# Altium schematic sheet 0266_GPU_VCCGT VREG PHA.SchDoc
size 848 x 558 mm
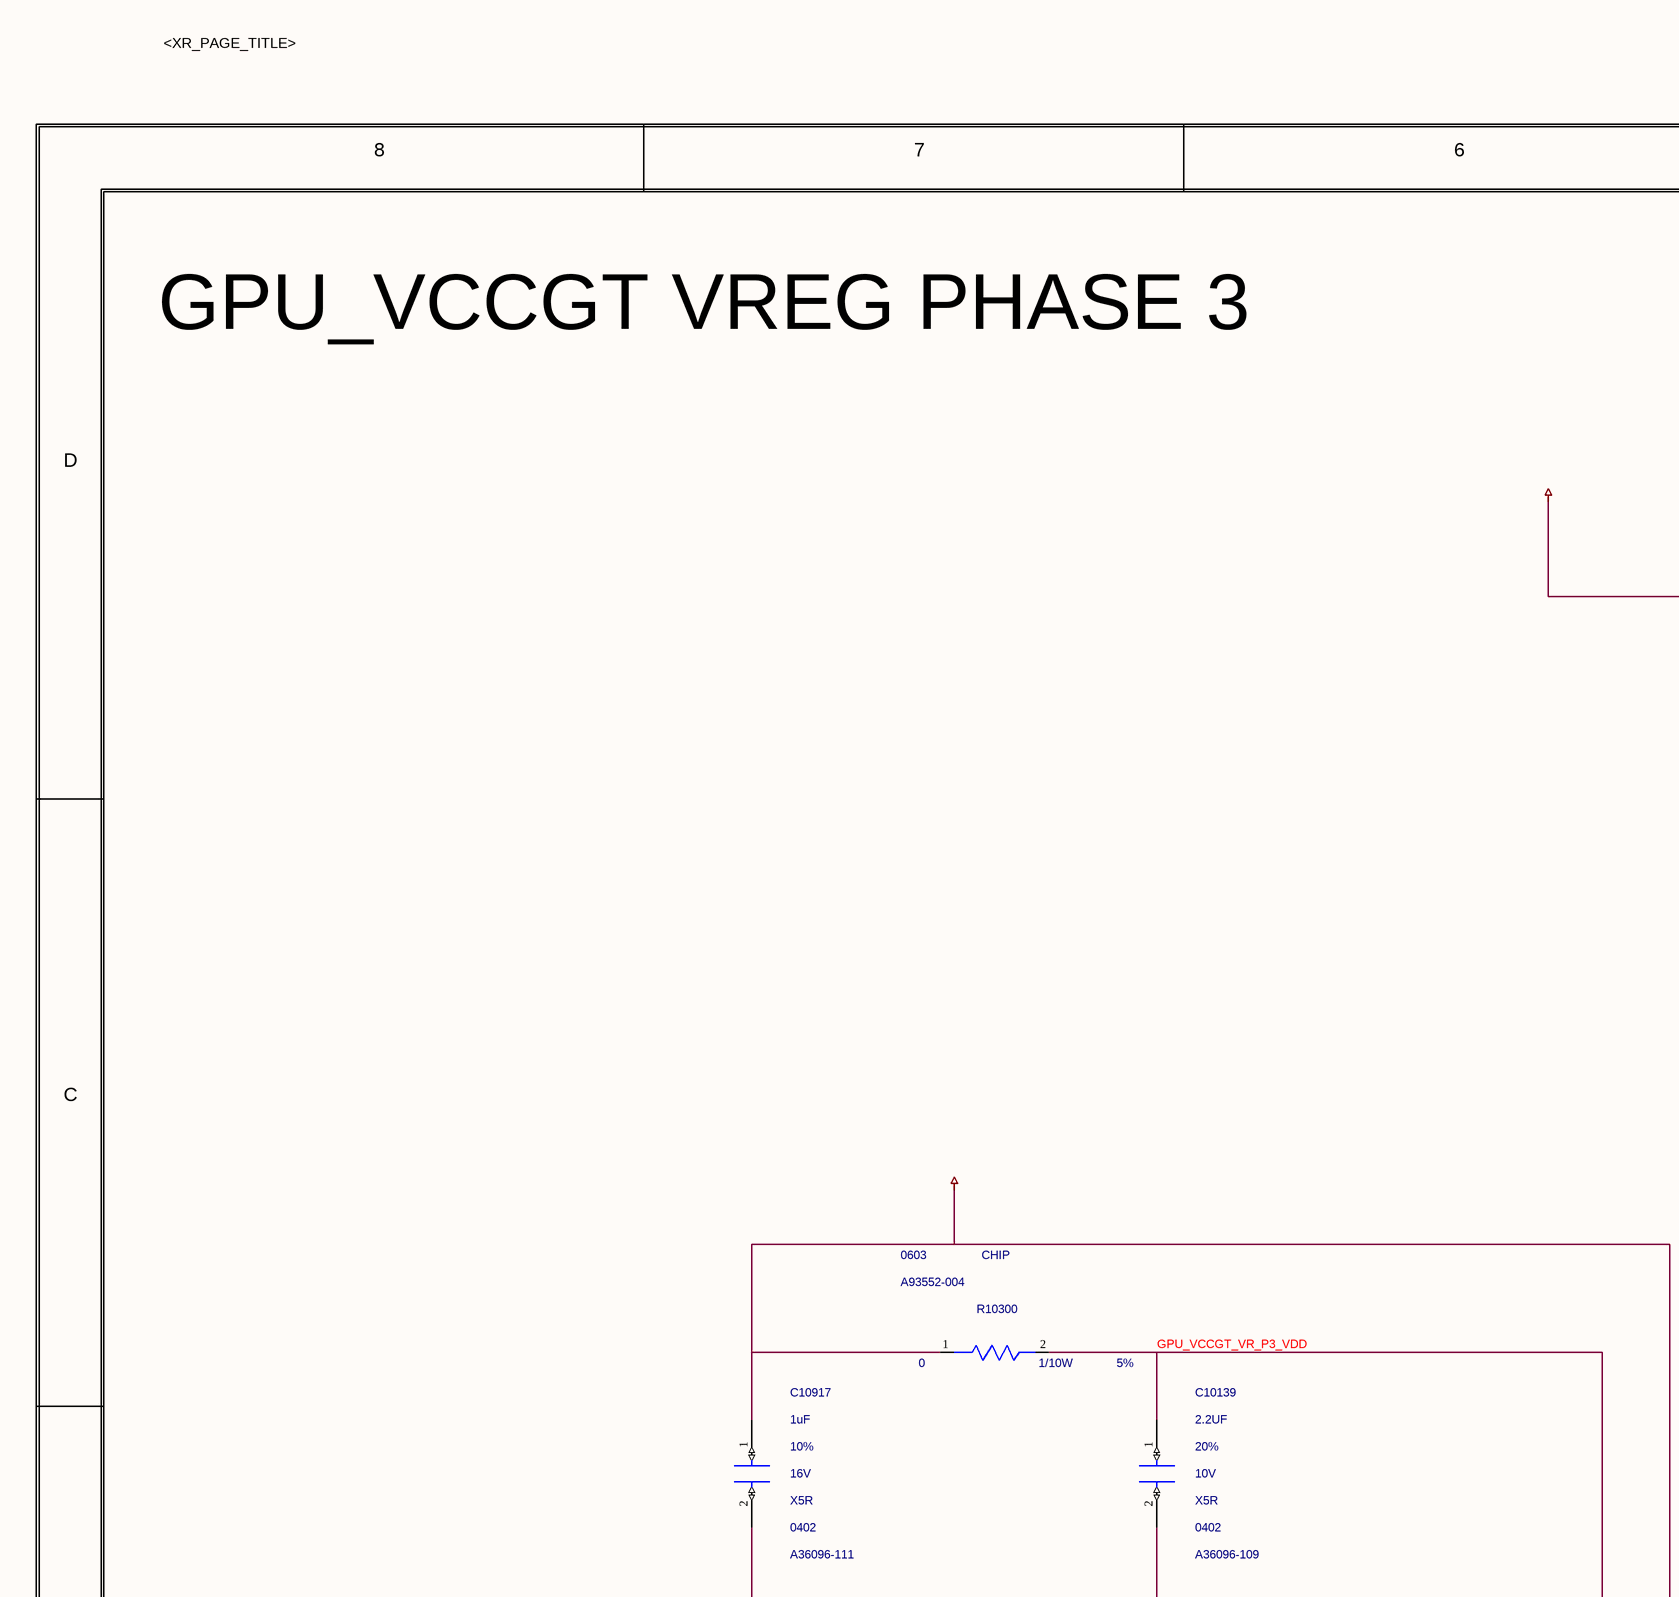
[diagram p0: 0266_GPU_VCCGT VREG PHA.SchDoc, top left]
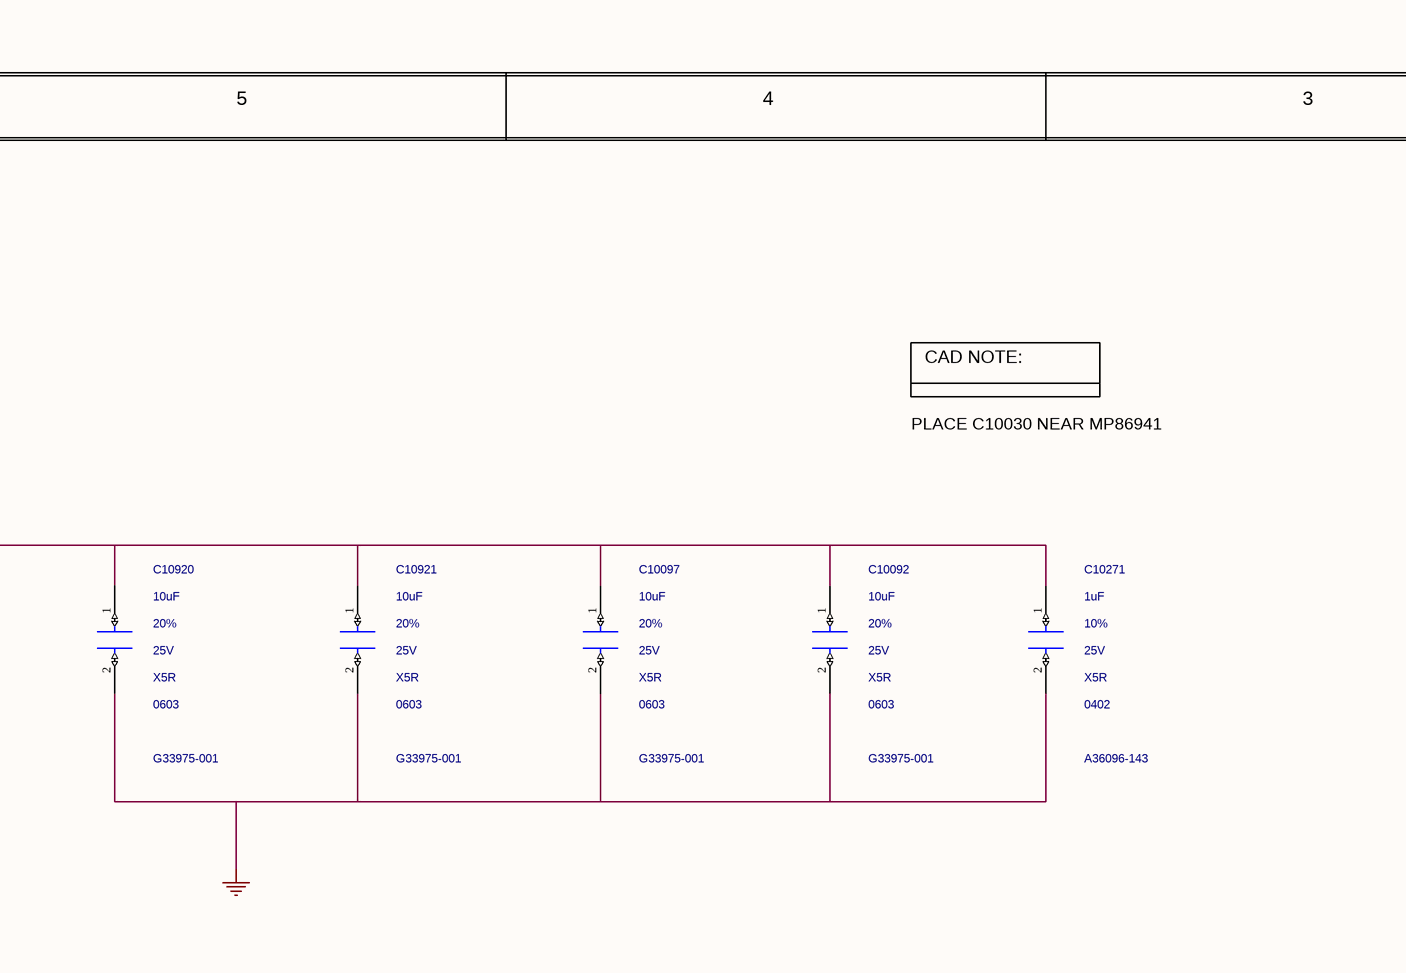
[diagram p1: 0266_GPU_VCCGT VREG PHA.SchDoc, top middle]
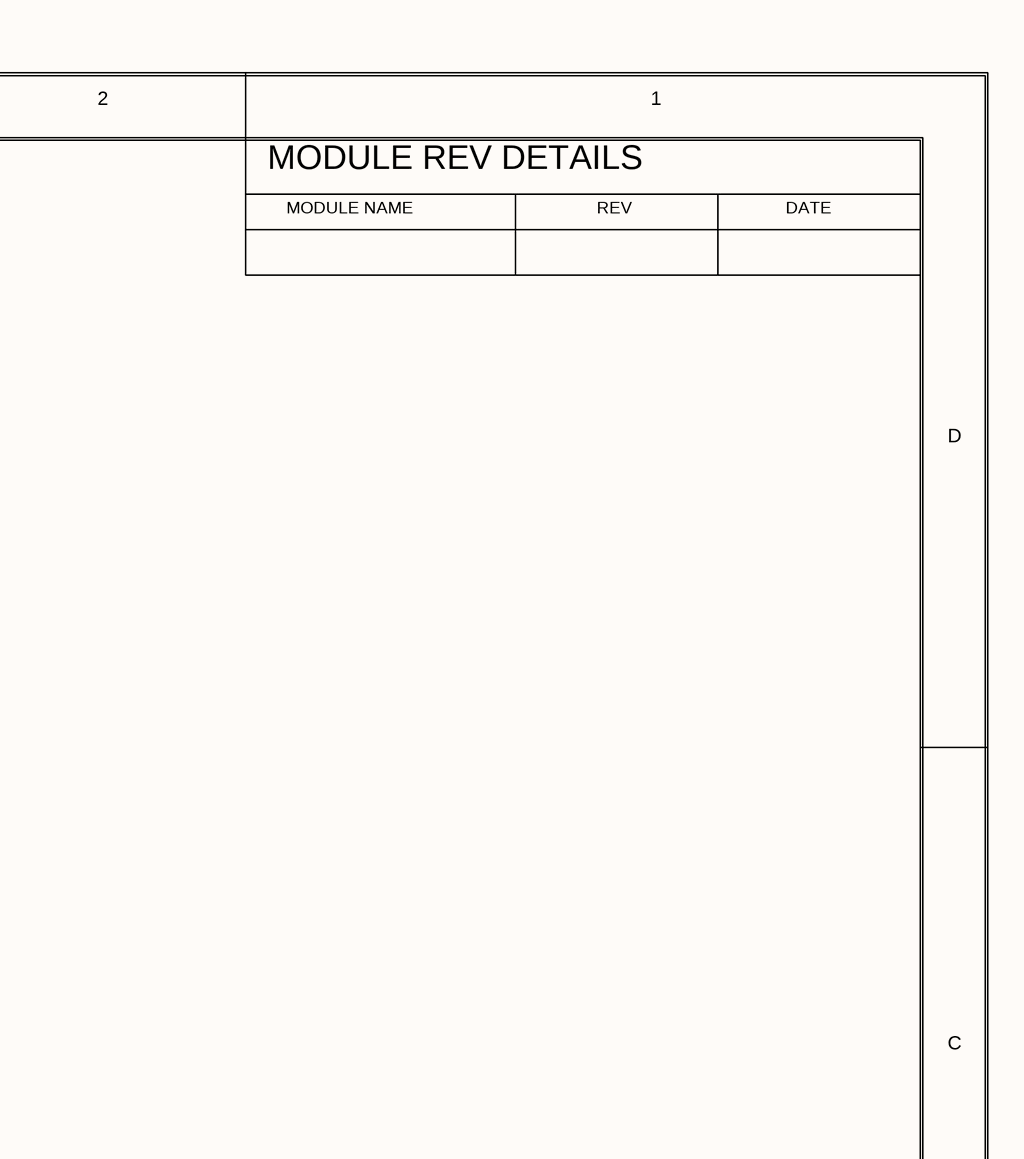
[diagram p2: 0266_GPU_VCCGT VREG PHA.SchDoc, top right]
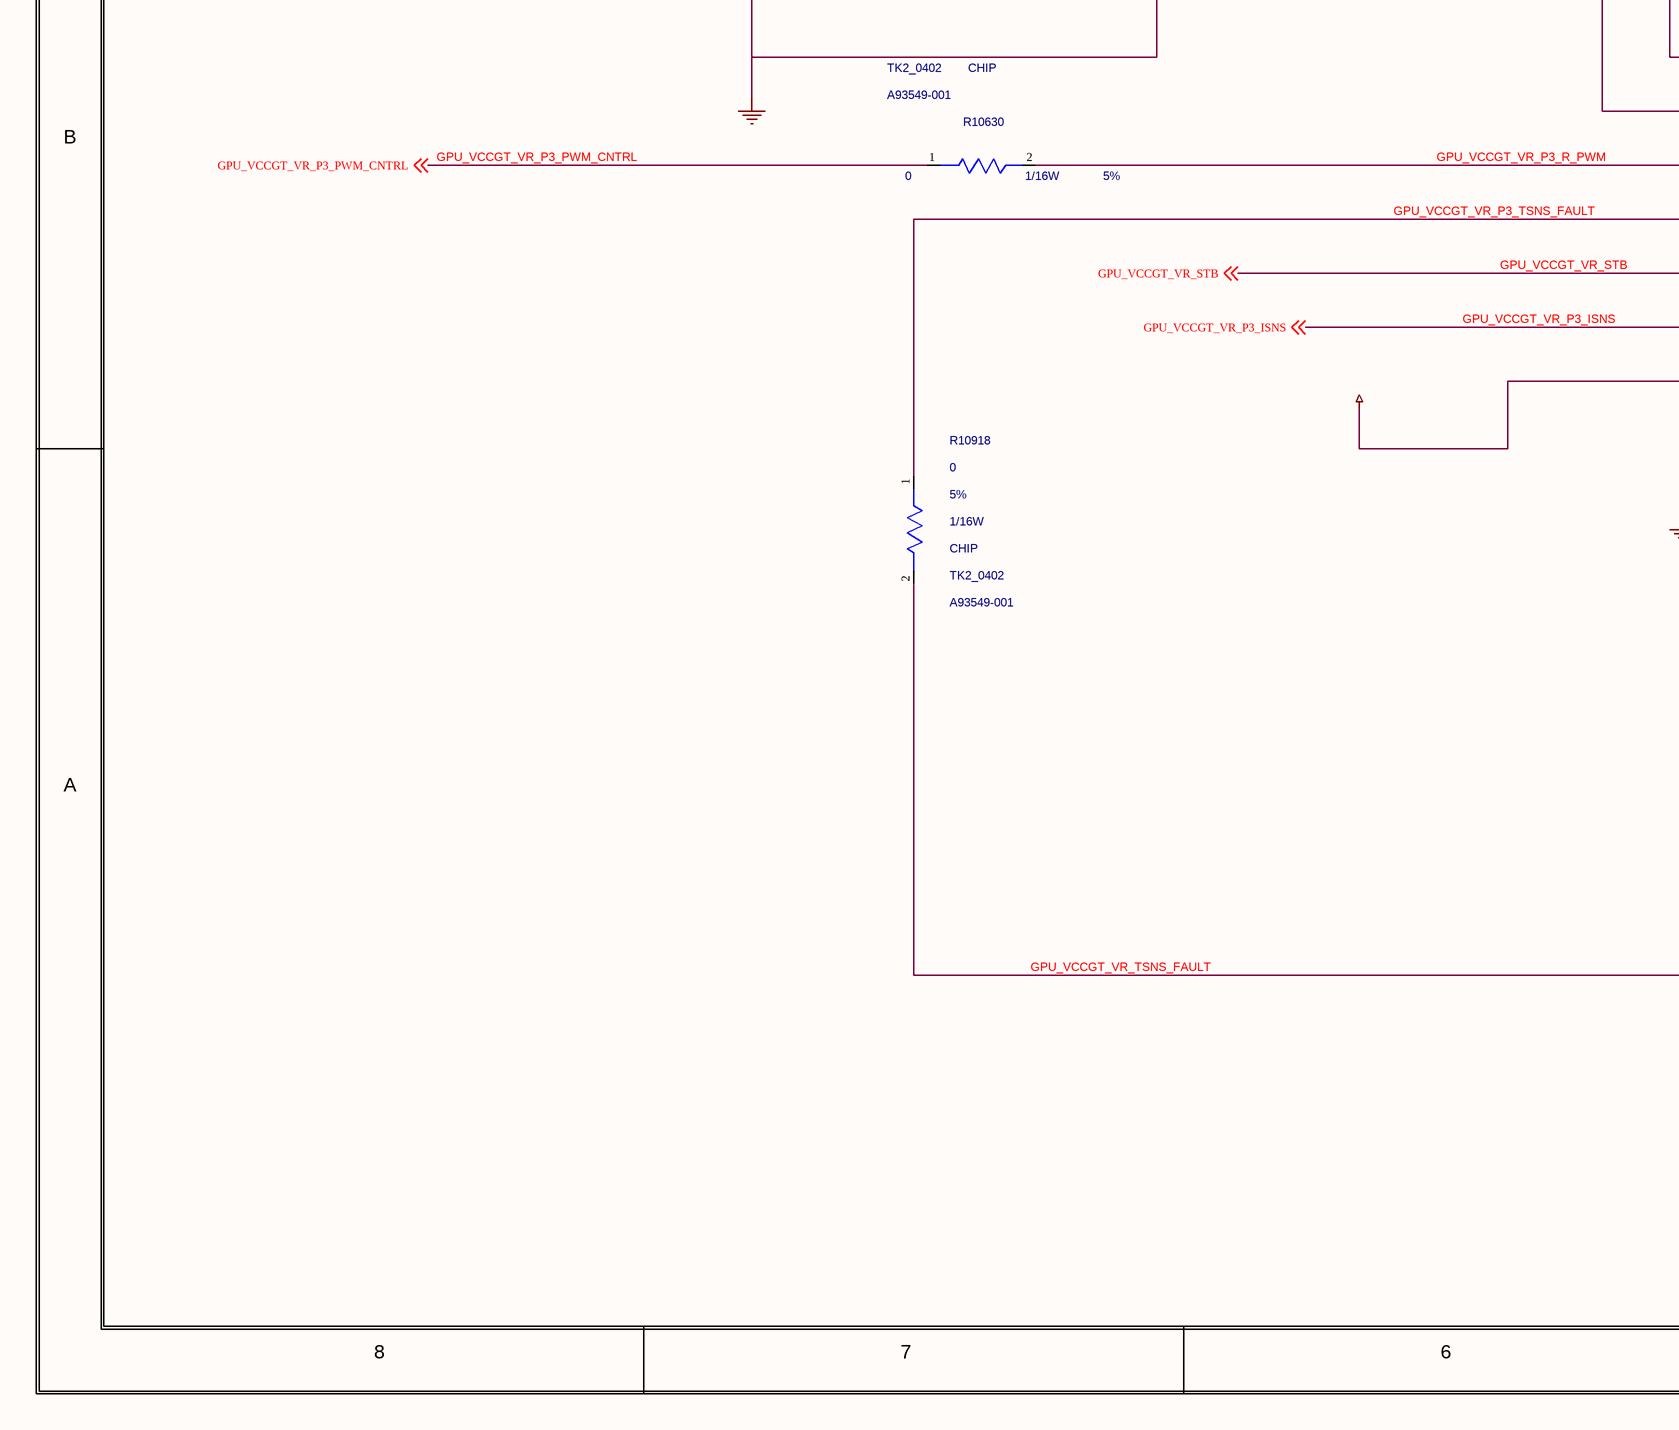
[diagram p3: 0266_GPU_VCCGT VREG PHA.SchDoc, bottom left]
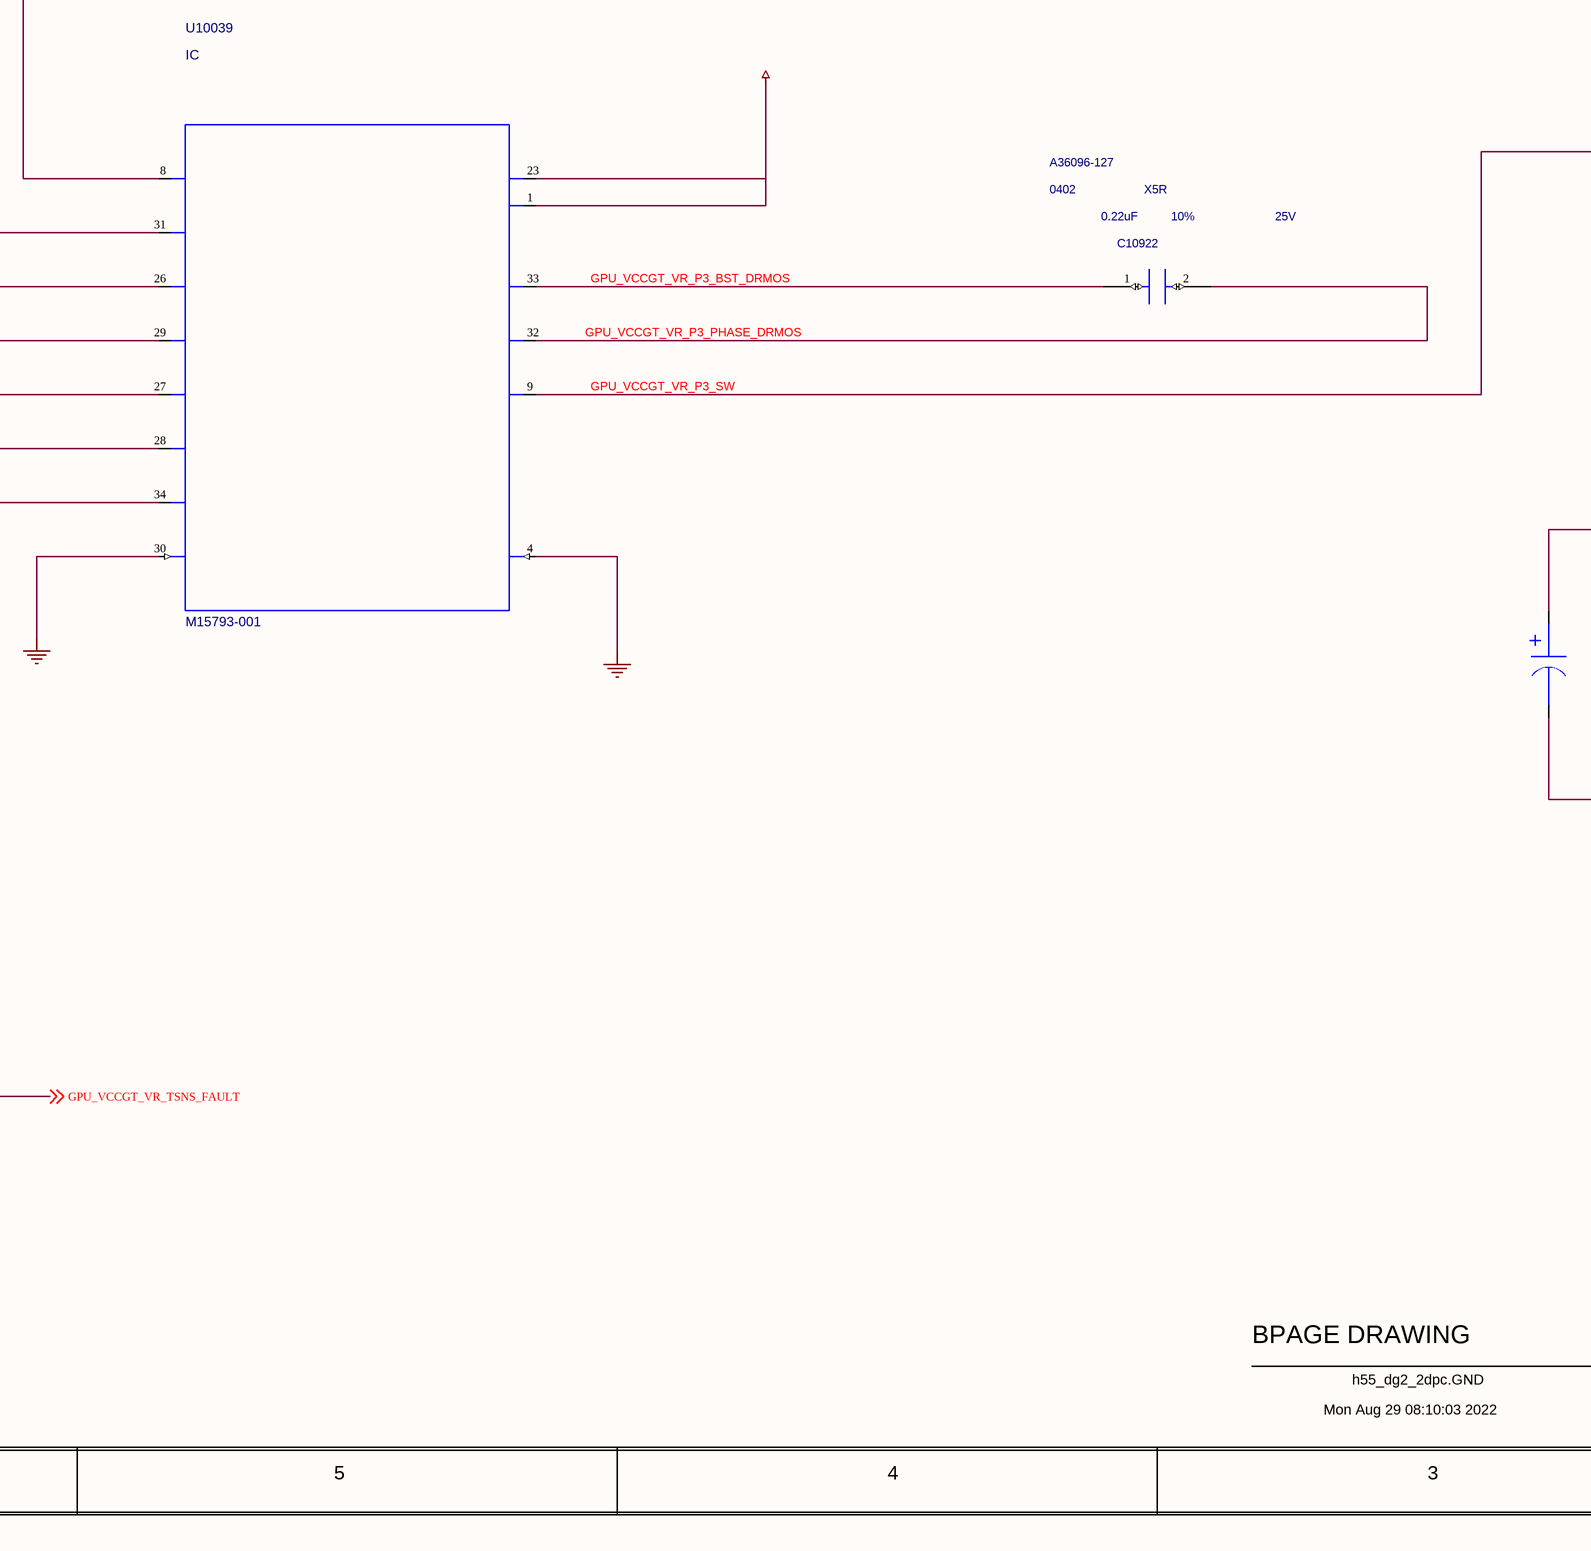
[diagram p4: 0266_GPU_VCCGT VREG PHA.SchDoc, bottom middle]
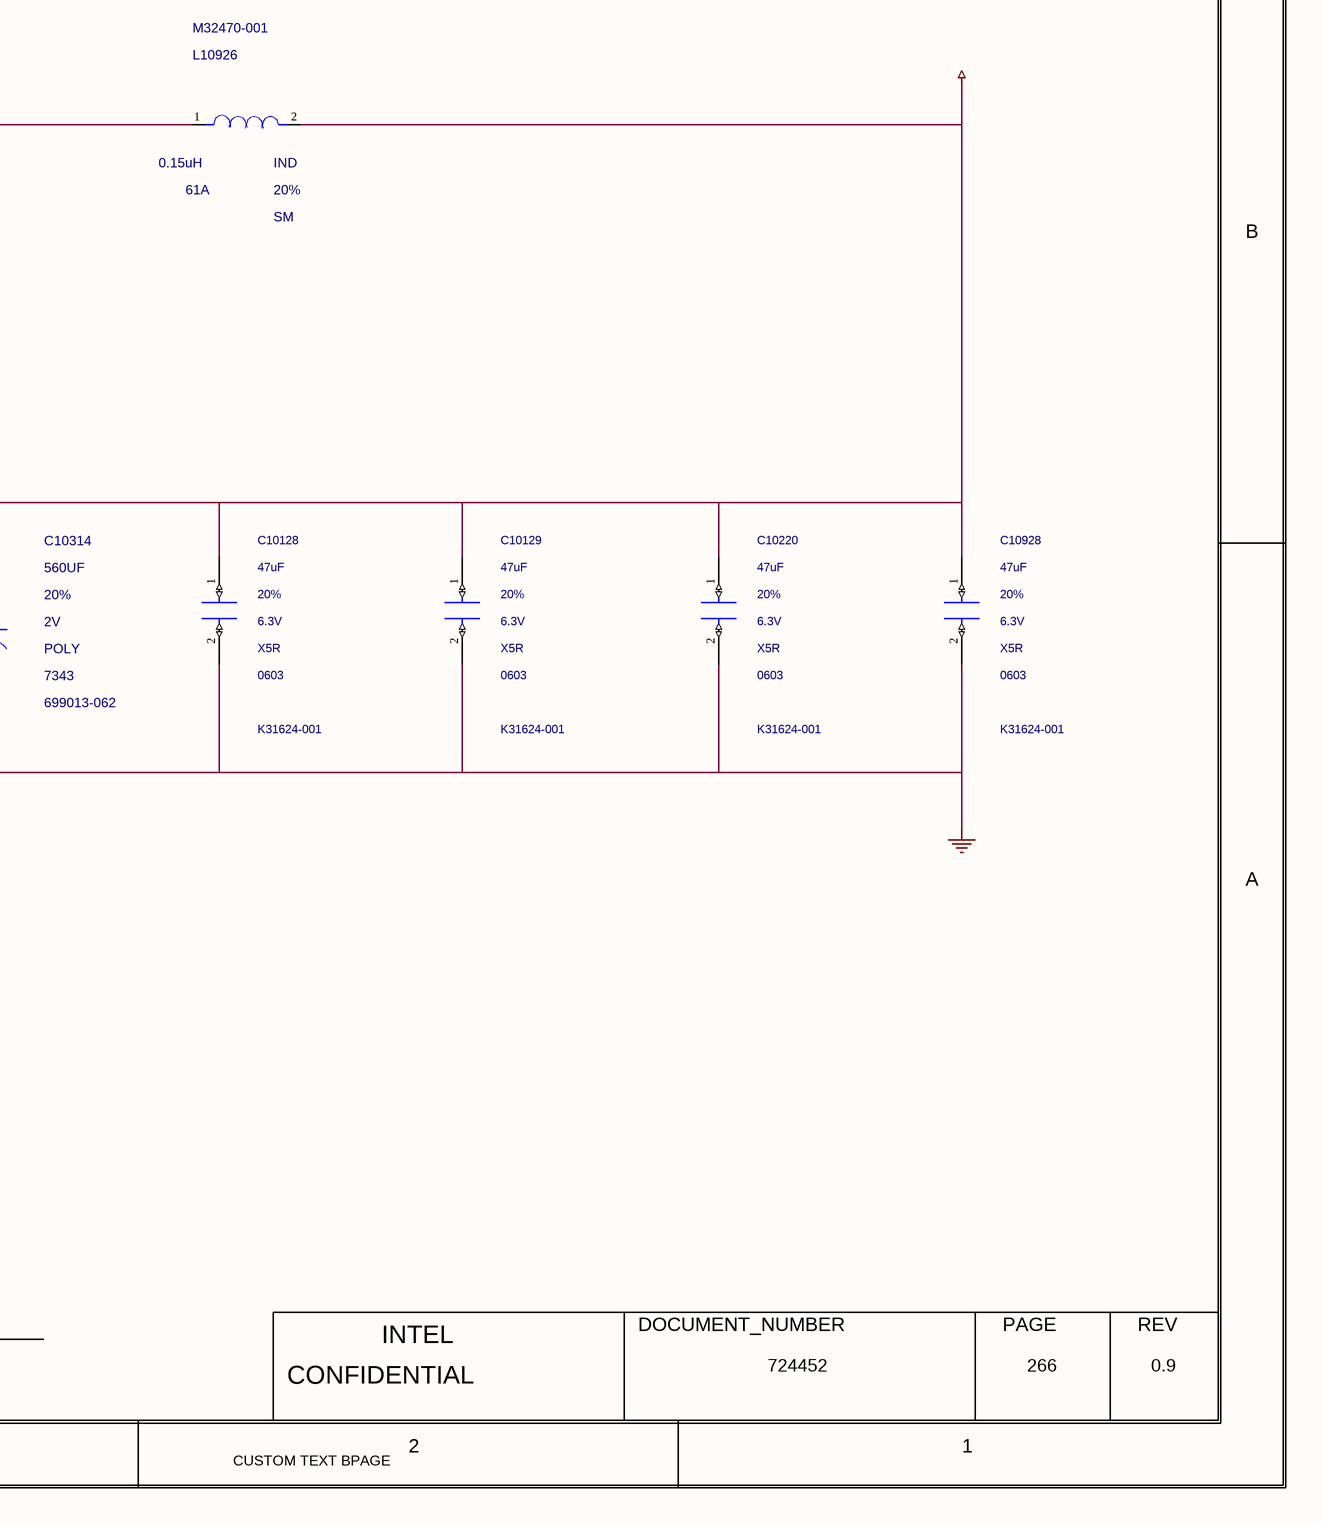
[diagram p5: 0266_GPU_VCCGT VREG PHA.SchDoc, bottom right]

## Parts
C10092  10uF  MATERIAL: X5R  PACK_TYPE: 0603  PART_NUMBER: G33975-001  TOLERANCE: 20%  VOLTAGE: 25V  [SMC0603IA]
C10097  10uF  MATERIAL: X5R  PACK_TYPE: 0603  PART_NUMBER: G33975-001  TOLERANCE: 20%  VOLTAGE: 25V  [SMC0603IA]
C10128  47uF  MATERIAL: X5R  PACK_TYPE: 0603  PART_NUMBER: K31624-001  TOLERANCE: 20%  VOLTAGE: 6.3V  [SMC0603ID]
C10129  47uF  MATERIAL: X5R  PACK_TYPE: 0603  PART_NUMBER: K31624-001  TOLERANCE: 20%  VOLTAGE: 6.3V  [SMC0603ID]
C10139  2.2UF  MATERIAL: X5R  PACK_TYPE: 0402  PART_NUMBER: A36096-109  TOLERANCE: 20%  VOLTAGE: 10V  [SMC0402IA]
C10220  47uF  MATERIAL: X5R  PACK_TYPE: 0603  PART_NUMBER: K31624-001  TOLERANCE: 20%  VOLTAGE: 6.3V  [SMC0603ID]
C10271  1uF  MATERIAL: X5R  PACK_TYPE: 0402  PART_NUMBER: A36096-143  TOLERANCE: 10%  VOLTAGE: 25V  [SMC0402MA]
C10314  560UF  MATERIAL: POLY  PACK_TYPE: 7343  PART_NUMBER: 699013-062  TOLERANCE: 20%  VOLTAGE: 2V  [CTK0_SMC7343M_7500X4500_TANT_MA]
C10917  1uF  MATERIAL: X5R  PACK_TYPE: 0402  PART_NUMBER: A36096-111  TOLERANCE: 10%  VOLTAGE: 16V  [SMC0402IA]
C10920  10uF  MATERIAL: X5R  PACK_TYPE: 0603  PART_NUMBER: G33975-001  TOLERANCE: 20%  VOLTAGE: 25V  [SMC0603IA]
C10921  10uF  MATERIAL: X5R  PACK_TYPE: 0603  PART_NUMBER: G33975-001  TOLERANCE: 20%  VOLTAGE: 25V  [SMC0603IA]
C10922  0.22uF  MATERIAL: X5R  PACK_TYPE: 0402  PART_NUMBER: A36096-127  TOLERANCE: 10%  VOLTAGE: 25V  [SMC1005MB]
C10928  47uF  MATERIAL: X5R  PACK_TYPE: 0603  PART_NUMBER: K31624-001  TOLERANCE: 20%  VOLTAGE: 6.3V  [SMC0603ID]
L10926  0.15uH  CURRENT: 61A  MATERIAL: IND  PACK_TYPE: SM  PART_NUMBER: M32470-001  TOLERANCE: 20%  [CTK2_SM_7300X6800_MA]
R10300  0  MATERIAL: CHIP  PACK_TYPE: 0603  PART_NUMBER: A93552-004  TOLERANCE: 5%  WATTAGE: 1/10W  [SMR0603IA]
R10630  0  MATERIAL: CHIP  PACK_TYPE: TK2_0402  PART_NUMBER: A93549-001  TOLERANCE: 5%  WATTAGE: 1/16W  [SMR1005MB]
R10918  0  MATERIAL: CHIP  PACK_TYPE: TK2_0402  PART_NUMBER: A93549-001  TOLERANCE: 5%  WATTAGE: 1/16W  [SMR1005MB]
U10039  MATERIAL: IC  PART_NUMBER: M15793-001  [CTK1_LCC34_4100X6100_450_DF4P_MA_VR]  (hidden comment: C_MP86959)

## Nets
+V3P3S_GPU: C10917.1(A) R10300.1(A) U10039.8(VDRV) U10039.34(TEST)
+VBATA_VCCGT_GPU: C10092.1(A) C10097.1(A) C10271.1(A) C10920.1(A) C10921.1(A) U10039.1(VIN_1) U10039.23(VIN_2)
+VCCGT_GPU: C10128.1(A) C10129.1(A) C10220.1(A) C10314.1(A) C10928.1(A) L10926.2(INB)
GND: C10092.2(B) C10097.2(B) C10128.2(B) C10129.2(B) C10139.2(B) C10220.2(B) C10271.2(B) C10314.2(B) C10917.2(B) C10920.2(B) C10921.2(B) C10928.2(B) U10039.4(PGND) U10039.30(AGND)
GPU_VCCGT_VR_P3_BST_DRMOS: C10922.1(A) U10039.33(BST)
GPU_VCCGT_VR_P3_ISNS: U10039.28(CS) ; off-sheet GPU_VCCGT_VR_P3_ISNS
GPU_VCCGT_VR_P3_PHASE_DRMOS: C10922.2(B) U10039.32(PHASE)
GPU_VCCGT_VR_P3_PWM_CNTRL: R10630.1(A) ; off-sheet GPU_VCCGT_VR_P3_PWM_CNTRL
GPU_VCCGT_VR_P3_R_PWM: R10630.2(B) U10039.26(PWM)
GPU_VCCGT_VR_P3_SW: L10926.1(INA) U10039.9(SW)
GPU_VCCGT_VR_P3_TSNS_FAULT: R10918.1(A) U10039.29(VTEMP_FLT)
GPU_VCCGT_VR_P3_VDD: C10139.1(A) R10300.2(B) U10039.31(VDD)
GPU_VCCGT_VR_STB: U10039.27(SYNC) ; off-sheet GPU_VCCGT_VR_STB
GPU_VCCGT_VR_TSNS_FAULT: R10918.2(B) ; off-sheet GPU_VCCGT_VR_TSNS_FAULT

## Notes on the sheet
- <XR_PAGE_TITLE>
- 8
- 7
- 6
- 5
- 4
- 3
- 2
- 1
- MODULE REV DETAILS
- MODULE NAME
- REV
- DATE
- GPU_VCCGT VREG PHASE 3
- CAD NOTE:
- D
- PLACE C10030 NEAR MP86941
- C
- B
- A
- BPAGE DRAWING
- INTEL
- DOCUMENT_NUMBER
- PAGE
- Mon Aug 29 08:10:03 2022
- h55_dg2_2dpc.GND
- CONFIDENTIAL
- 724452
- 266
- 0.9
- CUSTOM TEXT BPAGE

## Library data of the parts
C10092 = CAP: CDS_PHYS_PART_NAME: CAP_0603-G33975-001,X5R,10UF,25V,20%,LPDB,GENERIC; OriginalSymbolOrigin: (-50,25); XY: (1850,2775); VER: 1; ROT: 0; PHYS_PAGE: 266; LOCATION: C10092; DRAWING: @RVP1_ADL_SB_ADP_S_DDR5_SODIMM_2DPC_LIB.H55_DG2_2DPC(SCH_1):PAGE439; CDS_LIB: discrete; PCB Footprint: SMC0603IA; CHIPS_PART_NAME: CAP; CDS_PART_NAME: CAP_0603-G33975-001,X5R,10UF,25V,20%,LPDB,GENERIC; CDS_LOCATION: C10092
C10097 = CAP: CDS_PHYS_PART_NAME: CAP_0603-G33975-001,X5R,10UF,25V,20%,LPDB,GENERIC; OriginalSymbolOrigin: (-50,25); XY: (1425,2775); VER: 1; ROT: 0; PHYS_PAGE: 266; LOCATION: C10097; DRAWING: @RVP1_ADL_SB_ADP_S_DDR5_SODIMM_2DPC_LIB.H55_DG2_2DPC(SCH_1):PAGE439; CDS_LIB: discrete; PCB Footprint: SMC0603IA; CHIPS_PART_NAME: CAP; CDS_PART_NAME: CAP_0603-G33975-001,X5R,10UF,25V,20%,LPDB,GENERIC; CDS_LOCATION: C10097
C10128 = CAP: CDS_PHYS_PART_NAME: CAP_0603-K31624-001,X5R,47UF,6.3V,20%,LPDB,GENERIC; OriginalSymbolOrigin: (-50,25); XY: (3400,200); VER: 1; ROT: 0; PHYS_PAGE: 266; LOCATION: C10128; DRAWING: @RVP1_ADL_SB_ADP_S_DDR5_SODIMM_2DPC_LIB.H55_DG2_2DPC(SCH_1):PAGE439; CDS_LIB: discrete; PCB Footprint: SMC0603ID; CHIPS_PART_NAME: CAP; CDS_PART_NAME: CAP_0603-K31624-001,X5R,47UF,6.3V,20%,LPDB,GENERIC; CDS_LOCATION: C10128
C10129 = CAP: CDS_PHYS_PART_NAME: CAP_0603-K31624-001,X5R,47UF,6.3V,20%,LPDB,GENERIC; OriginalSymbolOrigin: (-50,25); XY: (3850,200); VER: 1; ROT: 0; PHYS_PAGE: 266; LOCATION: C10129; DRAWING: @RVP1_ADL_SB_ADP_S_DDR5_SODIMM_2DPC_LIB.H55_DG2_2DPC(SCH_1):PAGE439; CDS_LIB: discrete; PCB Footprint: SMC0603ID; CHIPS_PART_NAME: CAP; CDS_PART_NAME: CAP_0603-K31624-001,X5R,47UF,6.3V,20%,LPDB,GENERIC; CDS_LOCATION: C10129
C10139 = CAP: CDS_PHYS_PART_NAME: CAP_0402-A36096-109,X5R,2.2UF,10V,20%,LPDB,GENERIC; OriginalSymbolOrigin: (-50,25); XY: (-800,1325); VER: 1; ROT: 0; PHYS_PAGE: 266; LOCATION: C10139; DRAWING: @RVP1_ADL_SB_ADP_S_DDR5_SODIMM_2DPC_LIB.H55_DG2_2DPC(SCH_1):PAGE439; CDS_LIB: discrete; PCB Footprint: SMC0402IA; CHIPS_PART_NAME: CAP; CDS_PART_NAME: CAP_0402-A36096-109,X5R,2.2UF,10V,20%,LPDB,GENERIC; CDS_LOCATION: C10139
C10220 = CAP: CDS_PHYS_PART_NAME: CAP_0603-K31624-001,X5R,47UF,6.3V,20%,LPDB,GENERIC; OriginalSymbolOrigin: (-50,25); XY: (4325,200); VER: 1; ROT: 0; PHYS_PAGE: 266; LOCATION: C10220; DRAWING: @RVP1_ADL_SB_ADP_S_DDR5_SODIMM_2DPC_LIB.H55_DG2_2DPC(SCH_1):PAGE439; CDS_LIB: discrete; PCB Footprint: SMC0603ID; CHIPS_PART_NAME: CAP; CDS_PART_NAME: CAP_0603-K31624-001,X5R,47UF,6.3V,20%,LPDB,GENERIC; CDS_LOCATION: C10220
C10271 = CAP: CDS_PHYS_PART_NAME: CAP_0402-A36096-143,X5R,1UF,25V,10%,LPDB,GENERIC; OriginalSymbolOrigin: (-50,25); XY: (2250,2775); VER: 1; ROT: 0; PHYS_PAGE: 266; LOCATION: C10271; DRAWING: @RVP1_ADL_SB_ADP_S_DDR5_SODIMM_2DPC_LIB.H55_DG2_2DPC(SCH_1):PAGE439; CDS_LIB: discrete; PCB Footprint: SMC0402MA; CHIPS_PART_NAME: CAP; CDS_PART_NAME: CAP_0402-A36096-143,X5R,1UF,25V,10%,LPDB,GENERIC; CDS_LOCATION: C10271
C10314 = C_CAPP: CDS_PHYS_PART_NAME: C_CAPP_7343-699013-062,POLY,560UF,2V,20%,TK0,GENERIC; CDS_LMAN_SYM_OUTLINE: -50,100,50,-50; FP_TECH: TK0; IP: GENERIC; ROOM: NONE; OriginalSymbolOrigin: (-50,75); XY: (2975,150); VER: 1; ROT: 0; PHYS_PAGE: 266; LOCATION: C10314; DRAWING: @RVP1_ADL_SB_ADP_S_DDR5_SODIMM_2DPC_LIB.H55_DG2_2DPC(SCH_1):PAGE439; CDS_LIB: c_discrete; VARIANT: ?; PCB Footprint: CTK0_SMC7343M_7500X4500_TANT_MA; CHIPS_PART_NAME: C_CAPP; CDS_PART_NAME: C_CAPP_7343-699013-062,POLY,560UF,2V,20%,TK0,GENERIC; CDS_LOCATION: C10314
C10917 = CAP: CDS_PHYS_PART_NAME: CAP_0402-A36096-111,X5R,1UF,16V,10%,LPDB,GENERIC; OriginalSymbolOrigin: (-50,25); XY: (-1550,1325); VER: 1; ROT: 0; PHYS_PAGE: 266; LOCATION: C10917; DRAWING: @RVP1_ADL_SB_ADP_S_DDR5_SODIMM_2DPC_LIB.H55_DG2_2DPC(SCH_1):PAGE439; CDS_LIB: discrete; PCB Footprint: SMC0402IA; CHIPS_PART_NAME: CAP; CDS_PART_NAME: CAP_0402-A36096-111,X5R,1UF,16V,10%,LPDB,GENERIC; CDS_LOCATION: C10917
C10920 = CAP: CDS_PHYS_PART_NAME: CAP_0603-G33975-001,X5R,10UF,25V,20%,LPDB,GENERIC; OriginalSymbolOrigin: (-50,25); XY: (525,2775); VER: 1; ROT: 0; PHYS_PAGE: 266; LOCATION: C10920; DRAWING: @RVP1_ADL_SB_ADP_S_DDR5_SODIMM_2DPC_LIB.H55_DG2_2DPC(SCH_1):PAGE439; CDS_LIB: discrete; PCB Footprint: SMC0603IA; CHIPS_PART_NAME: CAP; CDS_PART_NAME: CAP_0603-G33975-001,X5R,10UF,25V,20%,LPDB,GENERIC; CDS_LOCATION: C10920
C10921 = CAP: CDS_PHYS_PART_NAME: CAP_0603-G33975-001,X5R,10UF,25V,20%,LPDB,GENERIC; OriginalSymbolOrigin: (-50,25); XY: (975,2775); VER: 1; ROT: 0; PHYS_PAGE: 266; LOCATION: C10921; DRAWING: @RVP1_ADL_SB_ADP_S_DDR5_SODIMM_2DPC_LIB.H55_DG2_2DPC(SCH_1):PAGE439; CDS_LIB: discrete; PCB Footprint: SMC0603IA; CHIPS_PART_NAME: CAP; CDS_PART_NAME: CAP_0603-G33975-001,X5R,10UF,25V,20%,LPDB,GENERIC; CDS_LOCATION: C10921
C10922 = CAP#1: CHIPS_PART_NAME: CAP; CDS_PHYS_PART_NAME: CAP_0402-A36096-127,X5R,0.22UF,25V,10%,LPDB,GENERIC; OriginalSymbolOrigin: (-25,50); XY: (2250,850); VER: 2; ROT: 0; PHYS_PAGE: 266; LOCATION: C10922; DRAWING: @RVP1_ADL_SB_ADP_S_DDR5_SODIMM_2DPC_LIB.H55_DG2_2DPC(SCH_1):PAGE439; CDS_LIB: discrete; PCB Footprint: SMC1005MB; CDS_PART_NAME: CAP_0402-A36096-127,X5R,0.22UF,25V,10%,LPDB,GENERIC; CDS_LOCATION: C10922
C10928 = CAP: CDS_PHYS_PART_NAME: CAP_0603-K31624-001,X5R,47UF,6.3V,20%,LPDB,GENERIC; OriginalSymbolOrigin: (-50,25); XY: (4775,200); VER: 1; ROT: 0; PHYS_PAGE: 266; LOCATION: C10928; DRAWING: @RVP1_ADL_SB_ADP_S_DDR5_SODIMM_2DPC_LIB.H55_DG2_2DPC(SCH_1):PAGE439; CDS_LIB: discrete; PCB Footprint: SMC0603ID; CHIPS_PART_NAME: CAP; CDS_PART_NAME: CAP_0603-K31624-001,X5R,47UF,6.3V,20%,LPDB,GENERIC; CDS_LOCATION: C10928
L10926 = C_INDUCTOR: CDS_PHYS_PART_NAME: C_INDUCTOR_SM-M32470-001,IND,0.15UH,20%,61A,TK2,GENERIC; CDS_LMAN_SYM_OUTLINE: -100,50,100,-50; FP_TECH: TK2; IP: GENERIC; ROOM: NONE; OriginalSymbolOrigin: (-75,25); XY: (3450,1100); VER: 1; ROT: 0; PHYS_PAGE: 266; LOCATION: L10926; DRAWING: @RVP1_ADL_SB_ADP_S_DDR5_SODIMM_2DPC_LIB.H55_DG2_2DPC(SCH_1):PAGE439; CDS_LIB: local; VARIANT: ?; PCB Footprint: CTK2_SM_7300X6800_MA; CHIPS_PART_NAME: C_INDUCTOR; CDS_PART_NAME: C_INDUCTOR_SM-M32470-001,IND,0.15UH,20%,61A,TK2,GENERIC; CDS_LOCATION: L10926
R10300 = RES#1: CHIPS_PART_NAME: RES; CDS_PHYS_PART_NAME: RES_0603-A93552-004,CHIP,0,5%,1/10W,LPDB,GENERIC; OriginalSymbolOrigin: (-75,25); XY: (-1100,1550); VER: 1; PHYS_PAGE: 266; LOCATION: R10300; IP: GENERIC; FP_TECH: LPDB; DRAWING: @RVP1_ADL_SB_ADP_S_DDR5_SODIMM_2DPC_LIB.H55_DG2_2DPC(SCH_1):PAGE439; CDS_LIB: discrete; PCB Footprint: SMR0603IA; ROT: 0; CDS_PART_NAME: RES_0603-A93552-004,CHIP,0,5%,1/10W,LPDB,GENERIC; CDS_LOCATION: R10300
R10630 = RES#1: CHIPS_PART_NAME: RES; CDS_PHYS_PART_NAME: RES_TK2_0402-A93549-001,CHIP,0,5%,1/16W,TK2,GENERIC; OriginalSymbolOrigin: (-75,25); XY: (-1125,850); VER: 1; PHYS_PAGE: 266; LOCATION: R10630; IP: GENERIC; FP_TECH: TK2; DRAWING: @RVP1_ADL_SB_ADP_S_DDR5_SODIMM_2DPC_LIB.H55_DG2_2DPC(SCH_1):PAGE439; CDS_LIB: discrete; PCB Footprint: SMR1005MB; ROT: 0; CDS_PART_NAME: RES_TK2_0402-A93549-001,CHIP,0,5%,1/16W,TK2,GENERIC; CDS_LOCATION: R10630
R10918 = RES: CDS_PHYS_PART_NAME: RES_TK2_0402-A93549-001,CHIP,0,5%,1/16W,TK2,GENERIC; OriginalSymbolOrigin: (-25,75); XY: (-1250,175); VER: 2; SUB_ROOM: VCCSA; PHYS_PAGE: 266; LOCATION: R10918; IP: GENERIC; FP_TECH: TK2; DRAWING: @RVP1_ADL_SB_ADP_S_DDR5_SODIMM_2DPC_LIB.H55_DG2_2DPC(SCH_1):PAGE439; CDS_LIB: discrete; PCB Footprint: SMR1005MB; ROT: 0; CHIPS_PART_NAME: RES; CDS_PART_NAME: RES_TK2_0402-A93549-001,CHIP,0,5%,1/16W,TK2,GENERIC; CDS_LOCATION: R10918
U10039 = C_MP86959: CDS_PHYS_PART_NAME: C_MP86959_LCC-M15793-001,IC,MP86959GMW,TK1,GENERIC; CDS_LMAN_SYM_OUTLINE: -300,450,300,-450; FP_TECH: TK1; IP: GENERIC; PACK_TYPE: LCC; ROOM: NONE; OriginalSymbolOrigin: (-325,450); XY: (750,700); VER: 1; ROT: 0; PHYS_PAGE: 266; LOCATION: U10039; DRAWING: @RVP1_ADL_SB_ADP_S_DDR5_SODIMM_2DPC_LIB.H55_DG2_2DPC(SCH_1):PAGE439; CDS_LIB: local; VARIANT: ?; PCB Footprint: CTK1_LCC34_4100X6100_450_DF4P_MA_VR; CHIPS_PART_NAME: C_MP86959; CDS_PART_NAME: C_MP86959_LCC-M15793-001,IC,MP86959GMW,TK1,GENERIC; CDS_LOCATION: U10039